# Altium schematic sheet PartB.SchDoc
size A4
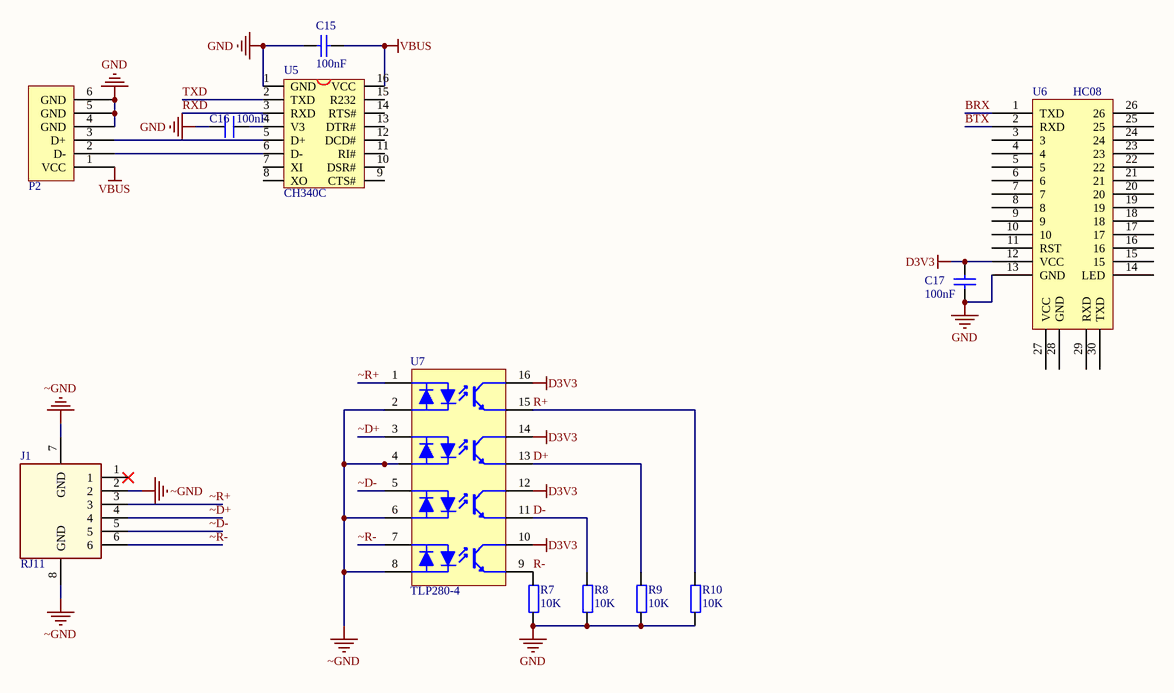
[diagram p0: PartB.SchDoc]

## Parts
C15  100nF  [0603C]
C16  100nF  [0603C]
C17  100nF  [0603C]
J1  RJ11  [RJ11]
P2  USB-B  [USB-B]  (value not drawn)
R7  10K  [0603R]
R8  10K  [0603R]
R9  10K  [0603R]
R10  10K  [0603R]
U5  CH340C  [SO-16]
U6  HC08  [HC-05/06/08V15]
U7  TLP280-4  [SOP16N_L]

## Nets
D3V3: C17.2 U6.12(VCC) U7.10 U7.12 U7.14 U7.16
GND: C15.1 C16.1 C17.1 P2.4(GND) P2.5(GND) P2.6(GND) R7.1 R8.1 R9.1 R10.1 U5.1(GND) U6.13(GND)
VBUS: C15.2 P2.1(VCC) U5.16(VCC)
~GND: J1.2 J1.7(GND) J1.8(GND) U7.2(K) U7.4(C) U7.6 U7.8
BRX: U6.1(TXD)
BTX: U6.2(RXD)
D+: R9.2 U7.13
D-: R8.2 U7.11
R+: R10.2 U7.15
R-: R7.2 U7.9
RXD: U5.3(RXD)
TXD: U5.2(TXD)
~D+: J1.4 U7.3(E)
~D-: J1.5 U7.5
~R+: J1.3 U7.1(A)
~R-: J1.6 U7.7
NetC16_2: C16.2 U5.4(V3)
NetP2_2: P2.2(D-) U5.6(D-)
NetP2_3: P2.3(D+) U5.5(D+)

Not connected (* = marked no-connect by the designer): J1 1* 9 10; U5 7(XI) 8(XO) 9(CTS#) 10(DSR#) 11(RI#) 12(DCD#) 13(DTR#) 14(RTS#) 15(R232); U6 3 4 5 6 7 8 9 10 11(RST) 14(LED) 15 16 17 18 19 20 21 22 23 24 25 26 27(VCC) 28(GND) 29(RXD) 30(TXD)

## Library data of the parts
C15 C17 = Cap: Capacitor; Published: 8-Jun-2000; LatestRevisionDate: 17-Jul-2002; LatestRevisionNote: Re-released for DXP Platform.; PackageReference: RAD-0.3; Publisher: Altium Limited; Value: 100nF
C16 = C
R7-R10 = R
U5 = CH340G: USB2UART
U7 = TLP280-4: 4组光耦; 版权归属: 源创客; BOM名称: 4组光耦; 学习资源: www.ooocke.com